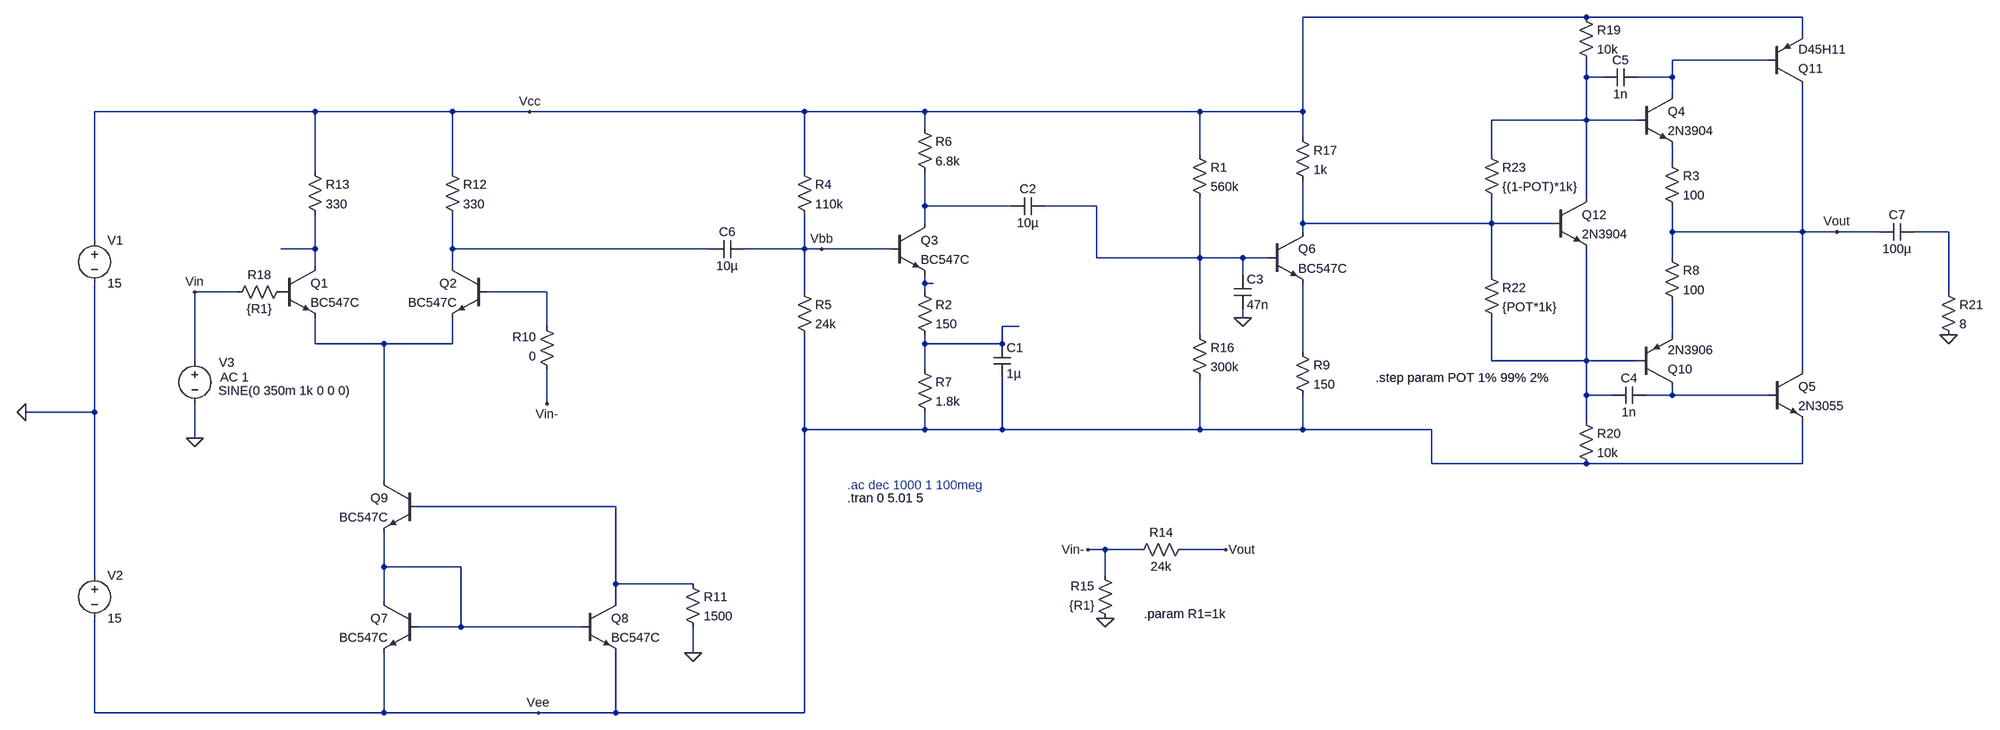
[diagram p0: schematic TPLAB v4.2.asc]
TPLAB v4.2.asc, the LTspice schematic file:
Version 4
SHEET 1 3652 1136
WIRE 2448 -336 1920 -336
WIRE 2896 -336 2448 -336
WIRE 2896 -304 2896 -336
WIRE 2832 -256 2608 -256
WIRE 2448 -224 2448 -256
WIRE 2480 -224 2448 -224
WIRE 2608 -224 2608 -256
WIRE 2608 -224 2544 -224
WIRE 2608 -192 2608 -224
WIRE 80 -160 -336 -160
WIRE 336 -160 80 -160
WIRE 480 -160 336 -160
WIRE 992 -160 480 -160
WIRE 1216 -160 992 -160
WIRE 1728 -160 1216 -160
WIRE 1920 -160 1920 -336
WIRE 1920 -160 1728 -160
WIRE 2448 -144 2448 -224
WIRE 2448 -144 2272 -144
WIRE 2544 -144 2448 -144
WIRE 1216 -128 1216 -160
WIRE 1920 -112 1920 -160
WIRE 1728 -80 1728 -160
WIRE 2272 -80 2272 -144
WIRE 2608 -64 2608 -96
WIRE 80 -48 80 -160
WIRE 336 -48 336 -160
WIRE 992 -48 992 -160
WIRE 2448 0 2448 -144
WIRE 1216 16 1216 -48
WIRE 1376 16 1216 16
WIRE 1536 16 1440 16
WIRE 1216 48 1216 16
WIRE 1920 48 1920 -32
WIRE 2272 48 2272 0
WIRE 2272 48 1920 48
WIRE 2384 48 2272 48
WIRE 1920 64 1920 48
WIRE 2608 64 2608 16
WIRE 2896 64 2896 -208
WIRE 2896 64 2608 64
WIRE 2960 64 2896 64
WIRE 3040 64 2960 64
WIRE 3168 64 3104 64
WIRE -336 80 -336 -160
WIRE 80 96 80 32
WIRE 80 96 16 96
WIRE 336 96 336 32
WIRE 816 96 336 96
WIRE 992 96 992 32
WIRE 992 96 880 96
WIRE 1024 96 992 96
WIRE 1152 96 1024 96
WIRE 1536 112 1536 16
WIRE 1728 112 1728 0
WIRE 1728 112 1536 112
WIRE 1808 112 1728 112
WIRE 1856 112 1808 112
WIRE 2608 112 2608 64
WIRE 80 128 80 96
WIRE 336 128 336 96
WIRE 1808 144 1808 112
WIRE 2272 144 2272 48
WIRE 1216 160 1216 144
WIRE 1232 160 1216 160
WIRE -64 176 -144 176
WIRE 512 176 400 176
WIRE 992 176 992 96
WIRE 1216 176 1216 160
WIRE 3168 176 3168 64
WIRE 1808 224 1808 208
WIRE 512 240 512 176
WIRE 1392 240 1360 240
WIRE 1728 256 1728 112
WIRE 2608 256 2608 192
WIRE 80 272 80 224
WIRE 208 272 80 272
WIRE 336 272 336 224
WIRE 336 272 208 272
WIRE 1216 272 1216 256
WIRE 1360 272 1360 240
WIRE 1360 272 1216 272
WIRE 1920 288 1920 160
WIRE -144 304 -144 176
WIRE 2272 304 2272 224
WIRE 2448 304 2448 96
WIRE 2448 304 2272 304
WIRE 2544 304 2448 304
WIRE 1216 320 1216 272
WIRE 2896 320 2896 64
WIRE 2448 368 2448 304
WIRE 2496 368 2448 368
WIRE 2608 368 2608 352
WIRE 2608 368 2560 368
WIRE 2832 368 2608 368
WIRE 512 384 512 320
WIRE -336 400 -336 160
WIRE -336 400 -464 400
WIRE 2448 416 2448 368
WIRE 992 432 992 256
WIRE 1216 432 1216 400
WIRE 1216 432 992 432
WIRE 1360 432 1360 336
WIRE 1360 432 1216 432
WIRE 1728 432 1728 336
WIRE 1728 432 1360 432
WIRE 1920 432 1920 368
WIRE 1920 432 1728 432
WIRE 2160 432 1920 432
WIRE -144 448 -144 384
WIRE 2160 496 2160 432
WIRE 2448 496 2160 496
WIRE 2896 496 2896 416
WIRE 2896 496 2448 496
WIRE 208 528 208 272
WIRE 640 576 272 576
WIRE 1552 656 1520 656
WIRE 1616 656 1552 656
WIRE 1776 656 1696 656
WIRE 208 688 208 624
WIRE 352 688 208 688
WIRE -336 704 -336 400
WIRE 1552 704 1552 656
WIRE 640 720 640 576
WIRE 784 720 640 720
WIRE 208 752 208 688
WIRE 640 752 640 720
WIRE 352 800 352 688
WIRE 352 800 272 800
WIRE 576 800 352 800
WIRE 784 848 784 800
WIRE -336 960 -336 784
WIRE 208 960 208 848
WIRE 208 960 -336 960
WIRE 496 960 208 960
WIRE 640 960 640 848
WIRE 640 960 496 960
WIRE 992 960 992 432
WIRE 992 960 640 960
FLAG -464 400 0
FLAG 1024 96 Vbb
FLAG -144 448 0
FLAG 480 -160 Vcc
FLAG 496 960 Vee
FLAG 784 848 0
FLAG 1552 784 0
FLAG 1520 656 Vin-
FLAG 512 384 Vin-
FLAG 1776 656 Vout
FLAG 1808 224 0
FLAG -144 176 Vin
FLAG 3168 256 0
FLAG 2960 64 Vout
DATAFLAG 1392 240 ""
DATAFLAG -240 960 ""
DATAFLAG 208 272 ""
DATAFLAG 16 96 ""
DATAFLAG 192 -160 ""
DATAFLAG 1296 16 ""
DATAFLAG 1920 240 ""
DATAFLAG 1888 432 ""
DATAFLAG 1232 160 ""
DATAFLAG 768 720 ""
DATAFLAG 464 176 ""
DATAFLAG -144 288 ""
DATAFLAG 1072 432 ""
DATAFLAG 640 96 ""
DATAFLAG 464 800 ""
DATAFLAG 1536 16 ""
DATAFLAG 2064 48 ""
SYMBOL npn 16 128 R0
SYMATTR InstName Q1
SYMATTR Value BC547C
SYMBOL npn 400 128 M0
SYMATTR InstName Q2
SYMATTR Value BC547C
SYMBOL voltage -336 64 R0
WINDOW 123 0 0 Left 0
WINDOW 39 0 0 Left 0
SYMATTR InstName V1
SYMATTR Value 15
SYMBOL voltage -336 688 R0
WINDOW 123 0 0 Left 0
WINDOW 39 0 0 Left 0
SYMATTR InstName V2
SYMATTR Value 15
SYMBOL res 976 -64 R0
SYMATTR InstName R4
SYMATTR Value 110k
SYMBOL res 976 160 R0
SYMATTR InstName R5
SYMATTR Value 24k
SYMBOL res 1200 -144 R0
SYMATTR InstName R6
SYMATTR Value 6.8k
SYMBOL res 1200 304 R0
SYMATTR InstName R7
SYMATTR Value 1.8k
SYMBOL cap 1344 272 R0
SYMATTR InstName C1
SYMATTR Value 1µ
SYMBOL cap 1440 0 R90
WINDOW 0 0 32 VBottom 2
WINDOW 3 32 32 VTop 2
SYMATTR InstName C2
SYMATTR Value 10µ
SYMBOL npn 1152 48 R0
SYMATTR InstName Q3
SYMATTR Value BC547C
SYMBOL res 1200 160 R0
SYMATTR InstName R2
SYMATTR Value 150
SYMBOL npn 1856 64 R0
SYMATTR InstName Q6
SYMATTR Value BC547C
SYMBOL res 1904 272 R0
SYMATTR InstName R9
SYMATTR Value 150
SYMBOL res 1712 -96 R0
SYMATTR InstName R1
SYMATTR Value 560k
SYMBOL npn 576 752 R0
SYMATTR InstName Q8
SYMATTR Value BC547C
SYMBOL res 768 704 R0
SYMATTR InstName R11
SYMATTR Value 1500
SYMBOL npn 272 752 M0
SYMATTR InstName Q7
SYMATTR Value BC547C
SYMBOL npn 272 528 M0
SYMATTR InstName Q9
SYMATTR Value BC547C
SYMBOL res 320 -64 R0
SYMATTR InstName R12
SYMATTR Value 330
SYMBOL res 64 -64 R0
SYMATTR InstName R13
SYMATTR Value 330
SYMBOL res 1712 640 R90
WINDOW 0 0 56 VBottom 2
WINDOW 3 32 56 VTop 2
SYMATTR InstName R14
SYMATTR Value 24k
SYMBOL res 1568 800 R180
WINDOW 0 36 76 Left 2
WINDOW 3 36 40 Left 2
SYMATTR InstName R15
SYMATTR Value {R1}
SYMBOL res 1712 240 R0
SYMATTR InstName R16
SYMATTR Value 300k
SYMBOL res 1904 -128 R0
SYMATTR InstName R17
SYMATTR Value 1k
SYMBOL res 528 336 R180
WINDOW 0 36 76 Left 2
WINDOW 3 36 40 Left 2
SYMATTR InstName R10
SYMATTR Value 0
SYMBOL res -80 192 R270
WINDOW 0 32 56 VTop 2
WINDOW 3 0 56 VBottom 2
SYMATTR InstName R18
SYMATTR Value {R1}
SYMBOL voltage -144 288 R0
WINDOW 123 47 47 Left 2
WINDOW 39 24 72 Left 2
WINDOW 3 44 72 Left 2
WINDOW 0 45 19 Left 2
SYMATTR Value2 AC 1
SYMATTR Value SINE(0 350m 1k 0 0 0)
SYMATTR InstName V3
SYMBOL cap 880 80 R90
WINDOW 0 0 32 VBottom 2
WINDOW 3 32 32 VTop 2
SYMATTR InstName C6
SYMATTR Value 10µ
SYMBOL cap 1792 144 R0
SYMATTR InstName C3
SYMATTR Value 47n
SYMBOL npn 2544 -192 R0
SYMATTR InstName Q4
SYMATTR Value 2N3904
SYMBOL npn 2832 320 R0
SYMATTR InstName Q5
SYMATTR Value 2N3055
SYMBOL pnp 2544 352 M180
SYMATTR InstName Q10
SYMATTR Value 2N3906
SYMBOL pnp 2832 -208 M180
SYMATTR InstName Q11
SYMATTR Value D45H11
SYMBOL res 2592 -80 R0
SYMATTR InstName R3
SYMATTR Value 100
SYMBOL res 2592 96 R0
SYMATTR InstName R8
SYMATTR Value 100
SYMBOL res 2432 -352 R0
SYMATTR InstName R19
SYMATTR Value 10k
SYMBOL res 2432 400 R0
SYMATTR InstName R20
SYMATTR Value 10k
SYMBOL cap 2560 352 R90
WINDOW 0 0 32 VBottom 2
WINDOW 3 32 32 VTop 2
SYMATTR InstName C4
SYMATTR Value 1n
SYMBOL cap 2544 -240 R90
WINDOW 0 0 32 VBottom 2
WINDOW 3 32 32 VTop 2
SYMATTR InstName C5
SYMATTR Value 1n
SYMBOL res 3152 160 R0
SYMATTR InstName R21
SYMATTR Value 8
SYMBOL cap 3104 48 R90
WINDOW 0 0 32 VBottom 2
WINDOW 3 32 32 VTop 2
SYMATTR InstName C7
SYMATTR Value 100µ
SYMBOL res 2256 128 R0
SYMATTR InstName R22
SYMATTR Value {POT*1k}
SYMBOL res 2256 -96 R0
SYMATTR InstName R23
SYMATTR Value {(1-POT)*1k}
SYMBOL npn 2384 0 R0
SYMATTR InstName Q12
SYMATTR Value 2N3904
TEXT 1072 560 Left 2 !.tran 0 5.01 5
TEXT 1624 776 Left 2 !.param R1=1k
TEXT 1072 536 Left 2 ;.ac dec 1000 1 100meg
TEXT 2056 336 Left 2 !.step param POT 1% 99% 2%

The netlist it stands for:
* TPLAB v4.2.asc
Q1 N008 P001 N014 0 BC547C
Q2 N009 N011 N014 0 BC547C
V1 Vcc 0 15
V2 0 Vee 15
R4 Vcc Vbb 110k
R5 Vbb Vee 24k
R6 Vcc N004 6.8k
R7 N012 Vee 1.8k
C1 N012 Vee 1µ
C2 N005 N004 10µ
Q3 N004 Vbb N010 0 BC547C
R2 N010 N012 150
Q6 N006 N005 N015 0 BC547C
R9 N015 Vee 150
R1 Vcc N005 560k
Q8 N018 N019 Vee 0 BC547C
R11 N018 0 1500
Q7 N019 N019 Vee 0 BC547C
Q9 N014 N018 N019 0 BC547C
R12 Vcc N009 330
R13 Vcc N008 330
R14 Vout Vin- 24k
R15 0 Vin- {R1}
R16 N005 Vee 300k
R17 Vcc N006 1k
R10 Vin- N011 0
R18 Vin P001 {R1}
V3 Vin 0 SINE(0 350m 1k 0 0 0) AC 1
C6 Vbb N009 10µ
C3 N005 0 47n
Q4 N001 N002 N003 0 2N3904
Q5 Vout N017 Vee 0 2N3055
Q10 N017 N016 N013 0 2N3906
Q11 Vout N001 Vcc 0 D45H11
R3 N003 Vout 100
R8 Vout N013 100
R19 Vcc N002 10k
R20 N016 Vee 10k
C4 N017 N016 1n
C5 N001 N002 1n
R21 N007 0 8
C7 N007 Vout 100µ
R22 N006 N016 {POT*1k}
R23 N002 N006 {(1-POT)*1k}
Q12 N002 N006 N016 0 2N3904
.model NPN NPN
.model PNP PNP
.lib standard.bjt
.tran 0 5.01 5
.param R1=1k
* .ac dec 1000 1 100meg
.step param POT 1% 99% 2%
.backanno
.end